# Altium schematic sheet Cell Voltage Sensing.SchDoc
size A4; SheetNumber: 5; SheetTotal: 8
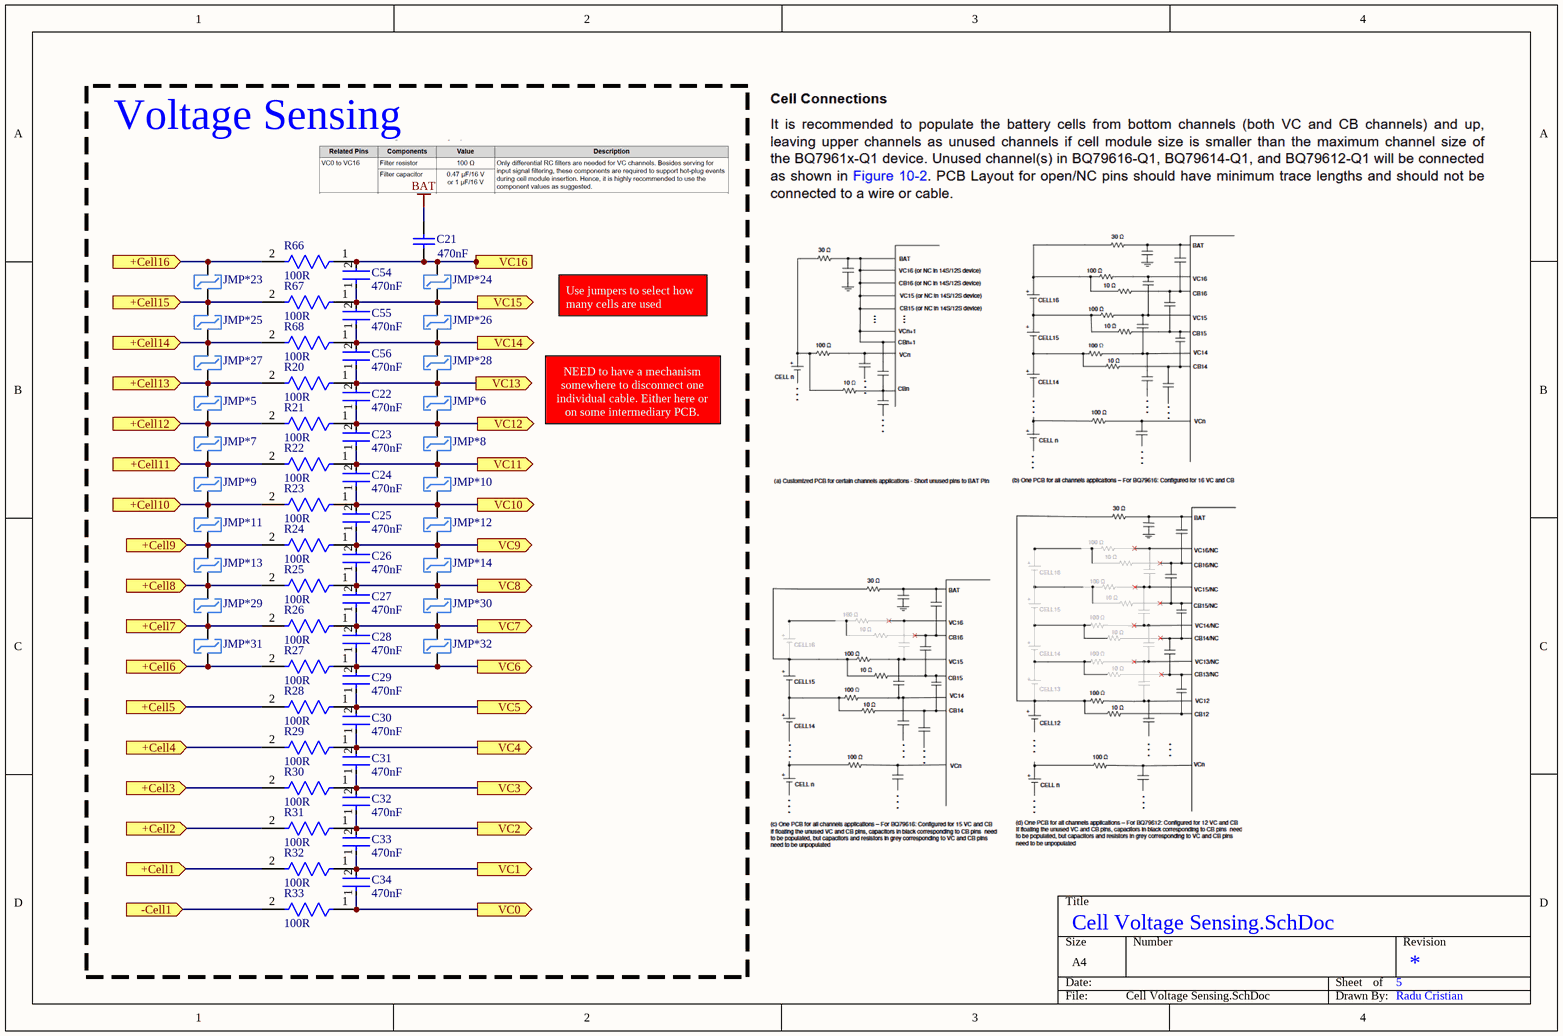
[diagram p0: Cell Voltage Sensing.SchDoc]

## Parts
C21  value 470nF  [CAPC0603(1608)100_N]  (hidden comment: CAP 470nF 25V 0603(1608))
C22  Capacitance: 470nF  [FP-0805-L_2_01_0_2-W_1_25-IPC_C]  (hidden comment: 08055C474J4Z2A)
C23  Capacitance: 470nF  [FP-0805-L_2_01_0_2-W_1_25-IPC_C]  (hidden comment: 08055C474J4Z2A)
C24  Capacitance: 470nF  [FP-0805-L_2_01_0_2-W_1_25-IPC_C]  (hidden comment: 08055C474J4Z2A)
C25  Capacitance: 470nF  [FP-0805-L_2_01_0_2-W_1_25-IPC_C]  (hidden comment: 08055C474J4Z2A)
C26  Capacitance: 470nF  [FP-0805-L_2_01_0_2-W_1_25-IPC_C]  (hidden comment: 08055C474J4Z2A)
C27  Capacitance: 470nF  [FP-0805-L_2_01_0_2-W_1_25-IPC_C]  (hidden comment: 08055C474J4Z2A)
C28  Capacitance: 470nF  [FP-0805-L_2_01_0_2-W_1_25-IPC_C]  (hidden comment: 08055C474J4Z2A)
C29  Capacitance: 470nF  [FP-0805-L_2_01_0_2-W_1_25-IPC_C]  (hidden comment: 08055C474J4Z2A)
C30  Capacitance: 470nF  [FP-0805-L_2_01_0_2-W_1_25-IPC_C]  (hidden comment: 08055C474J4Z2A)
C31  Capacitance: 470nF  [FP-0805-L_2_01_0_2-W_1_25-IPC_C]  (hidden comment: 08055C474J4Z2A)
C32  Capacitance: 470nF  [FP-0805-L_2_01_0_2-W_1_25-IPC_C]  (hidden comment: 08055C474J4Z2A)
C33  Capacitance: 470nF  [FP-0805-L_2_01_0_2-W_1_25-IPC_C]  (hidden comment: 08055C474J4Z2A)
C34  Capacitance: 470nF  [FP-0805-L_2_01_0_2-W_1_25-IPC_C]  (hidden comment: 08055C474J4Z2A)
C54  Capacitance: 470nF  [FP-0805-L_2_01_0_2-W_1_25-IPC_C]  (hidden comment: 08055C474J4Z2A)
C55  Capacitance: 470nF  [FP-0805-L_2_01_0_2-W_1_25-IPC_C]  (hidden comment: 08055C474J4Z2A)
C56  Capacitance: 470nF  [FP-0805-L_2_01_0_2-W_1_25-IPC_C]  (hidden comment: 08055C474J4Z2A)
JMP*5  Solder Jumper  [Solder Jumper-Footprint-1]  (value not drawn)
JMP*6  Solder Jumper  [Solder Jumper-Footprint-1]  (value not drawn)
JMP*7  Solder Jumper  [Solder Jumper-Footprint-1]  (value not drawn)
JMP*8  Solder Jumper  [Solder Jumper-Footprint-1]  (value not drawn)
JMP*9  Solder Jumper  [Solder Jumper-Footprint-1]  (value not drawn)
JMP*10  Solder Jumper  [Solder Jumper-Footprint-1]  (value not drawn)
JMP*11  Solder Jumper  [Solder Jumper-Footprint-1]  (value not drawn)
JMP*12  Solder Jumper  [Solder Jumper-Footprint-1]  (value not drawn)
JMP*13  Solder Jumper  [Solder Jumper-Footprint-1]  (value not drawn)
JMP*14  Solder Jumper  [Solder Jumper-Footprint-1]  (value not drawn)
JMP*23  Solder Jumper  [Solder Jumper-Footprint-1]  (value not drawn)
JMP*24  Solder Jumper  [Solder Jumper-Footprint-1]  (value not drawn)
JMP*25  Solder Jumper  [Solder Jumper-Footprint-1]  (value not drawn)
JMP*26  Solder Jumper  [Solder Jumper-Footprint-1]  (value not drawn)
JMP*27  Solder Jumper  [Solder Jumper-Footprint-1]  (value not drawn)
JMP*28  Solder Jumper  [Solder Jumper-Footprint-1]  (value not drawn)
JMP*29  Solder Jumper  [Solder Jumper-Footprint-1]  (value not drawn)
JMP*30  Solder Jumper  [Solder Jumper-Footprint-1]  (value not drawn)
JMP*31  Solder Jumper  [Solder Jumper-Footprint-1]  (value not drawn)
JMP*32  Solder Jumper  [Solder Jumper-Footprint-1]  (value not drawn)
R20  Resistance: 100R  [FP-CRCW0603-Pe3-MFG]  (hidden comment: CRCW0603100RFHEAP)
R21  Resistance: 100R  [FP-CRCW0603-Pe3-MFG]  (hidden comment: CRCW0603100RFHEAP)
R22  Resistance: 100R  [FP-CRCW0603-Pe3-MFG]  (hidden comment: CRCW0603100RFHEAP)
R23  Resistance: 100R  [FP-CRCW0603-Pe3-MFG]  (hidden comment: CRCW0603100RFHEAP)
R24  Resistance: 100R  [FP-CRCW0603-Pe3-MFG]  (hidden comment: CRCW0603100RFHEAP)
R25  Resistance: 100R  [FP-CRCW0603-Pe3-MFG]  (hidden comment: CRCW0603100RFHEAP)
R26  Resistance: 100R  [FP-CRCW0603-Pe3-MFG]  (hidden comment: CRCW0603100RFHEAP)
R27  Resistance: 100R  [FP-CRCW0603-Pe3-MFG]  (hidden comment: CRCW0603100RFHEAP)
R28  Resistance: 100R  [FP-CRCW0603-Pe3-MFG]  (hidden comment: CRCW0603100RFHEAP)
R29  Resistance: 100R  [FP-CRCW0603-Pe3-MFG]  (hidden comment: CRCW0603100RFHEAP)
R30  Resistance: 100R  [FP-CRCW0603-Pe3-MFG]  (hidden comment: CRCW0603100RFHEAP)
R31  Resistance: 100R  [FP-CRCW0603-Pe3-MFG]  (hidden comment: CRCW0603100RFHEAP)
R32  Resistance: 100R  [FP-CRCW0603-Pe3-MFG]  (hidden comment: CRCW0603100RFHEAP)
R33  Resistance: 100R  [FP-CRCW0603-Pe3-MFG]  (hidden comment: CRCW0603100RFHEAP)
R66  Resistance: 100R  [FP-CRCW0603-Pe3-MFG]  (hidden comment: CRCW0603100RFHEAP)
R67  Resistance: 100R  [FP-CRCW0603-Pe3-MFG]  (hidden comment: CRCW0603100RFHEAP)
R68  Resistance: 100R  [FP-CRCW0603-Pe3-MFG]  (hidden comment: CRCW0603100RFHEAP)

## Blocks framed on the sheet
Voltage Sensing: C21-C34 C54-C56 JMP*5-JMP*14 JMP*23-JMP*32 R20-R33 R66-R68

## Ports
+Cell1 (in, see Cell Balancing[1D], Connectors[1A]), +Cell2 (in, see Cell Balancing[1D], Connectors[1B]), +Cell3 (in, see Cell Balancing[1C], Connectors[1B]), +Cell4 (in, see Cell Balancing[1C], Connectors[1B]), +Cell5 (in, see Cell Balancing[1C], Connectors[1B]), +Cell6 (in, see Cell Balancing[1C], Connectors[1B]), +Cell7 (in, see Cell Balancing[1C], Connectors[2A]), +Cell8 (in, see Cell Balancing[1C], Connectors[2A]), +Cell9 (in, see Cell Balancing[1B], Connectors[2A]), +Cell10 (in, see Cell Balancing[1B], Connectors[2B]), +Cell11 (in, see Cell Balancing[1B], Connectors[2B]), +Cell12 (in, see Cell Balancing[1B], Connectors[2B]), +Cell13 (in, see Cell Balancing[1B], Connectors[2B]), +Cell14 (in, see Cell Balancing[1B], Connectors[2B]), +Cell15 (in, see Cell Balancing[1B], Connectors[2B]), +Cell16 (in, see Cell Balancing[1A], Connectors[2B]), -Cell1 (in, see Cell Balancing[1D], Connectors[1A]), VC0 (out, see BQ chip[2C]), VC1 (out, see BQ chip[2C]), VC2 (out, see BQ chip[2D]), VC3 (out, see BQ chip[2D]), VC4 (out, see BQ chip[2D]), VC5 (out, see BQ chip[2D]), VC6 (out, see BQ chip[2D]), VC7 (out, see BQ chip[2D]), VC8 (out, see BQ chip[2D]), VC9 (out, see BQ chip[2D]), VC10 (out, see BQ chip[1C]), VC11 (out, see BQ chip[1C]), VC12 (out, see BQ chip[1C]), VC13 (out, see BQ chip[1B]), VC14 (out, see BQ chip[1B]), VC15 (out, see BQ chip[1B]), VC16 (out, see BQ chip[1B])

## Nets
BAT: C21.2
+Cell1: R32.2 ; port +Cell1
+Cell2: R31.2 ; port +Cell2
+Cell3: R30.2 ; port +Cell3
+Cell4: R29.2 ; port +Cell4
+Cell5: R28.2 ; port +Cell5
+Cell6: JMP*31.1 R27.2 ; port +Cell6
+Cell7: JMP*29.1 JMP*31.2 R26.2 ; port +Cell7
+Cell8: JMP*13.1 JMP*29.2 R25.2 ; port +Cell8
+Cell9: JMP*11.1 JMP*13.2 R24.2 ; port +Cell9
+Cell10: JMP*9.1 JMP*11.2 R23.2 ; port +Cell10
+Cell11: JMP*7.1 JMP*9.2 R22.2 ; port +Cell11
+Cell12: JMP*5.1 JMP*7.2 R21.2 ; port +Cell12
+Cell13: JMP*5.2 JMP*27.1 R20.2 ; port +Cell13
+Cell14: JMP*25.1 JMP*27.2 R68.2 ; port +Cell14
+Cell15: JMP*23.1 JMP*25.2 R67.2 ; port +Cell15
+Cell16: JMP*23.2 R66.2 ; port +Cell16
-Cell1: R33.2 ; port -Cell1
VC0: C34.1 R33.1 ; port VC0
VC1: C33.1 C34.2 R32.1 ; port VC1
VC2: C32.1 C33.2 R31.1 ; port VC2
VC3: C31.1 C32.2 R30.1 ; port VC3
VC4: C30.1 C31.2 R29.1 ; port VC4
VC5: C29.1 C30.2 R28.1 ; port VC5
VC6: C28.1 C29.2 JMP*32.1 R27.1 ; port VC6
VC7: C27.1 C28.2 JMP*30.1 JMP*32.2 R26.1 ; port VC7
VC8: C26.1 C27.2 JMP*14.1 JMP*30.2 R25.1 ; port VC8
VC9: C25.1 C26.2 JMP*12.1 JMP*14.2 R24.1 ; port VC9
VC10: C24.1 C25.2 JMP*10.1 JMP*12.2 R23.1 ; port VC10
VC11: C23.1 C24.2 JMP*8.1 JMP*10.2 R22.1 ; port VC11
VC12: C22.1 C23.2 JMP*6.1 JMP*8.2 R21.1 ; port VC12
VC13: C22.2 C56.1 JMP*6.2 JMP*28.1 R20.1 ; port VC13
VC14: C55.1 C56.2 JMP*26.1 JMP*28.2 R68.1 ; port VC14
VC15: C54.1 C55.2 JMP*24.1 JMP*26.2 R67.1 ; port VC15
VC16: C21.1 C54.2 JMP*24.2 R66.1 ; port VC16

## Notes on the sheet
- Use jumpers to select how many cells are used
- NEED to have a mechanism somewhere to disconnect one individual cable. Either here or on some intermediary PCB.
- Radu Cristian

## Library data of the parts
C21 = CMP-1035-02704-1: CAP 470nF 25V ±20% 0603 (1608 Metric) Thickness 1mm SMD; Case-Metric: 1608; Case-EIA: 0603; Tolerance: Â±20%; Technology: SMT; Rated Voltage: 25 V; Max Thickness: 1 mm
C22-C34 C54-C56 = CMP-04427-003155-1: Automotive Ceramic Capacitor, 0805, 470nF, 5%, X7R, 15%, 50V; Dielectric: X7R; Depth: 1.25mm; Max Operating Temperature: 125°C; Mount: Surface Mount; Radiation Hardening: No; Construction: Flat; Packaging: Tape and Reel; Min Operating Temperature: -55°C; Length: 2.01mm; RoHS Compliant: Yes; Voltage Rating (DC): 50V; Case/Package: 0805; Tolerance: 5%; Package Quantity: 2000
JMP*5-JMP*14 JMP*23-JMP*32 = CMP-00000-3: 2 port solder jumper
R20-R33 R66-R68 = CMP-03613-000095-1: RES Thick Film, 100Ω, 1%, 0.1W, 50ppm/°C, 0603; Max Power Dissipation: 100mW; Military Standard: Not; Package Quantity: 5000; Length: 0.061inch; Case/Package: 0603; Packaging: Tape and Reel; Height: 0.02inch; Min Operating Temperature: -55°C; RoHS Compliant: Yes; Series: CRCW-P; Width: 0.033inch; Tolerance: 1%; Resistor Type: Thick Film; Temperature Coefficient: 50ppm/°C; Number of Terminations: 2; Depth: 0.85mm; Features: Automotive AEC-Q200; Max Operating Temperature: 155°C